# EAGLE design plcc20 (EAGLE 5.11)
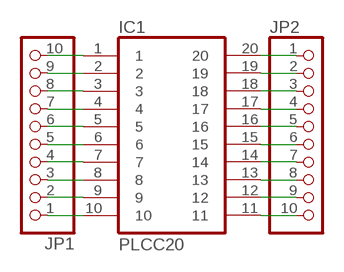
[diagram p0: schematic, sheet 1]

## Parts
IC1  PLCC20  20-DEVPLCC20  [PLCC20]
JP1  PINHD-1X10  [1X10]
JP2  PINHD-1X10  [1X10]

## Nets
N$1: IC1.1 JP1.10
N$2: IC1.2 JP1.9
N$3: IC1.3 JP1.8
N$4: IC1.4 JP1.7
N$5: IC1.5 JP1.6
N$6: IC1.6 JP1.5
N$7: IC1.7 JP1.4
N$8: IC1.8 JP1.3
N$9: IC1.9 JP1.2
N$10: IC1.10 JP1.1
N$11: IC1.11 JP2.10
N$12: IC1.12 JP2.9
N$13: IC1.13 JP2.8
N$14: IC1.14 JP2.7
N$15: IC1.15 JP2.6
N$16: IC1.16 JP2.5
N$17: IC1.17 JP2.4
N$18: IC1.18 JP2.3
N$19: IC1.19 JP2.2
N$20: IC1.20 JP2.1

## Library data of the parts
IC1 = packages:20-DEV
JP1 JP2 = pinhead:PINHD-1X10: PIN HEADER

## Board
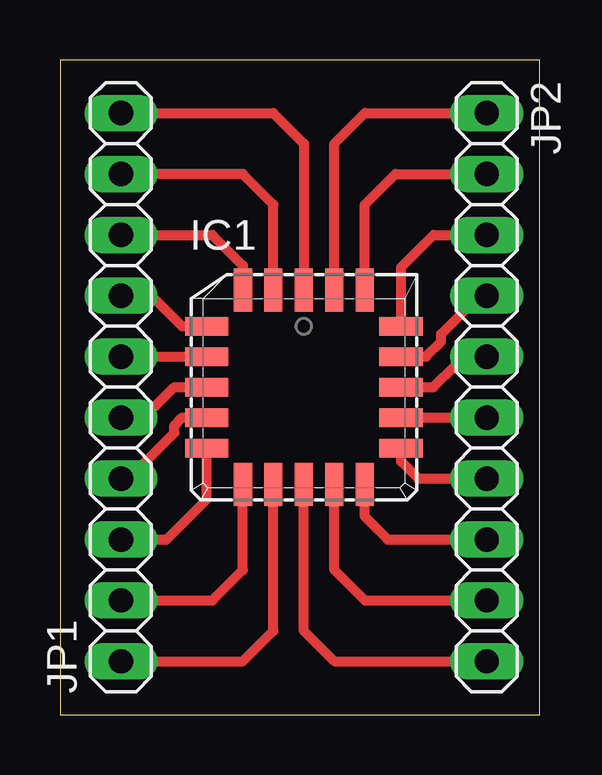
[diagram p1: board, top side]

Size 19.99 x 27.3 mm. Coordinates in mm from the lower left corner, seen from the top.
Outline: 0,0 19.99,0 19.99,27.3 0,27.3 0,0
Copper layers (1*16): Top 0.035mm / dielectric 1.5mm / Bottom 0.035mm
Design rules "default": minimum track width 10mil, minimum drill 24mil, track to track 8mil, track to pad 8mil, pad to pad 8mil, via to via 8mil, smd to smd 8mil, copper to edge 40mil, drill to drill 8mil, minimum pad ring 10mil, minimum via ring 8mil, stop-mask expansion 4mil, vias tented up to drill 0mil, thermal gap 10mil

### Footprints (pad centres in the part's own frame; a part is rotated, then mirrored left to right if it is on the bottom)
PLCC20 = smd 0.76 x 1.8: 1 0,4.05; 2 -1.27,4.05; 3 -2.54,4.05; 9 -2.54,-4.05; 10 -1.27,-4.05; 11 0,-4.05; 12 1.27,-4.05; 13 2.54,-4.05; 19 2.54,4.05; 20 1.27,4.05 | smd 1.8 x 0.76: 4 -4.05,2.54; 5 -4.05,1.27; 6 -4.05,0; 7 -4.05,-1.27; 8 -4.05,-2.54; 14 4.05,-2.54; 15 4.05,-1.27; 16 4.05,0; 17 4.05,1.27; 18 4.05,2.54
1X10 = drill 1.016 long: 1 -11.43,0; 2 -8.89,0; 3 -6.35,0; 4 -3.81,0; 5 -1.27,0; 6 1.27,0; 7 3.81,0; 8 6.35,0; 9 8.89,0; 10 11.43,0

### Placement (x,y rotation side)
IC1  10.16,13.65 0 top
JP1  2.54,13.65 90 top
JP2  17.78,13.65 270 top

### Tracks (layer width: path | path; a pad name or v marks a point on that pad's centre or on a via)
N$1
  Top 0.406: IC1.1 10.16,23.81 8.89,25.08 JP1.10
N$2
  Top 0.406: IC1.2 8.89,21.27 7.62,22.54 JP1.9
N$3
  Top 0.406: IC1.3 7.62,18.73 6.35,20 JP1.8
N$4
  Top 0.406: IC1.4 5.08,16.19 3.81,17.46 JP1.7
N$5
  Top 0.406: JP1.6 IC1.5
N$6
  Top 0.406: IC1.6 4.76,13.65 3.49,12.38 JP1.5
N$7
  Top 0.406: IC1.7 5.08,12.38 4.76,12.06 4.76,11.75 2.86,9.84 JP1.4
N$8
  Top 0.406: IC1.8 6.11,8.97 4.45,7.3 JP1.3
N$9
  Top 0.406: IC1.9 7.62,6.03 6.35,4.76 JP1.2
N$10
  Top 0.406: IC1.10 8.89,3.49 7.62,2.22 JP1.1
N$11
  Top 0.406: IC1.11 10.16,3.49 11.43,2.22 JP2.10
N$12
  Top 0.406: IC1.12 11.43,6.03 12.7,4.76 JP2.9
N$13
  Top 0.406: IC1.13 12.7,8.26 13.65,7.3 JP2.8
N$14
  Top 0.406: IC1.14 14.21,10.55 14.92,9.84 JP2.7
N$15
  Top 0.406: IC1.15 JP2.6
N$16
  Top 0.406: IC1.16 15.56,13.65 16.51,14.61 17.46,14.61 JP2.5
N$17
  Top 0.406: IC1.17 15.24,14.92 15.88,15.56 15.88,15.88 17.46,17.46 JP2.4
N$18
  Top 0.406: IC1.18 14.21,18.66 15.56,20 JP2.3
N$19
  Top 0.406: IC1.19 12.7,21.27 13.97,22.54 JP2.2
N$20
  Top 0.406: IC1.20 11.43,23.81 12.7,25.08 JP2.1

### Text on the board
tDocu: 1 | 20 | PLCC20 | 10 | 11